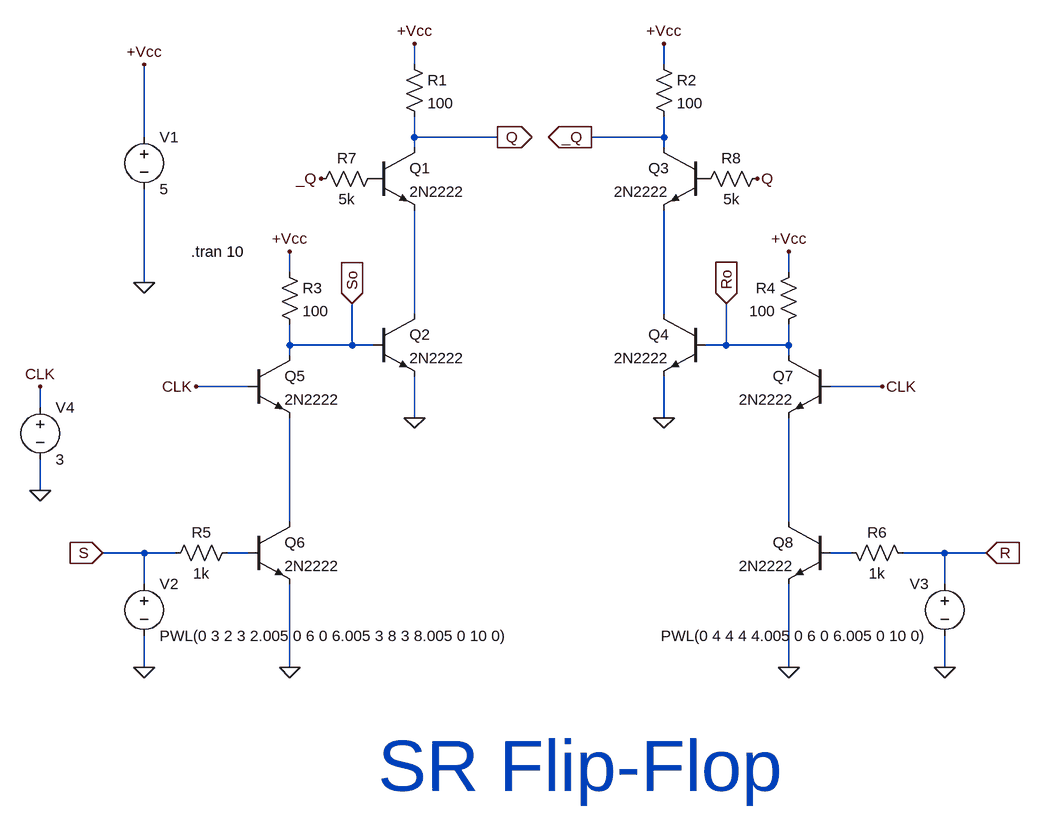
[diagram p0: schematic SR Flip-Flop.asc]
SR Flip-Flop.asc, the LTspice schematic file:
Version 4
SHEET 1 1500 1808
WIRE 80 -112 80 -144
WIRE 464 -112 464 -144
WIRE -336 0 -336 -112
WIRE 80 0 80 -32
WIRE 208 0 80 0
WIRE 464 0 464 -32
WIRE 464 0 352 0
WIRE 80 16 80 0
WIRE 464 16 464 0
WIRE -112 208 -112 176
WIRE 656 208 656 176
WIRE -336 224 -336 80
WIRE 80 272 80 112
WIRE 464 272 464 112
WIRE -112 320 -112 288
WIRE -16 320 -16 256
WIRE -16 320 -112 320
WIRE 16 320 -16 320
WIRE 560 320 560 256
WIRE 560 320 528 320
WIRE 656 320 656 288
WIRE 656 320 560 320
WIRE -112 336 -112 320
WIRE 656 336 656 320
WIRE -176 384 -256 384
WIRE 800 384 720 384
WIRE -496 416 -496 384
WIRE 80 432 80 368
WIRE 464 432 464 368
WIRE -496 544 -496 496
WIRE -112 592 -112 432
WIRE 656 592 656 432
WIRE -336 640 -400 640
WIRE -288 640 -336 640
WIRE -176 640 -208 640
WIRE 752 640 720 640
WIRE 896 640 832 640
WIRE 960 640 896 640
WIRE -336 688 -336 640
WIRE 896 688 896 640
WIRE -336 816 -336 768
WIRE -112 816 -112 688
WIRE 656 816 656 688
WIRE 896 816 896 768
FLAG 80 -144 +Vcc
FLAG 464 -144 +Vcc
FLAG -112 176 +Vcc
FLAG -112 816 0
FLAG 656 176 +Vcc
FLAG 656 816 0
FLAG 208 0 Q
IOPIN 208 0 Out
FLAG 352 0 _Q
IOPIN 352 0 Out
FLAG 464 432 0
FLAG 80 432 0
FLAG 560 256 Ro
IOPIN 560 256 In
FLAG -16 256 So
IOPIN -16 256 In
FLAG -336 -112 +Vcc
FLAG -336 224 0
FLAG -336 816 0
FLAG -400 640 S
IOPIN -400 640 In
FLAG 896 816 0
FLAG 960 640 R
IOPIN 960 640 In
FLAG -256 384 CLK
FLAG 800 384 CLK
FLAG 608 64 Q
FLAG -64 64 _Q
FLAG -496 544 0
FLAG -496 384 CLK
SYMBOL npn 16 16 R0
SYMATTR InstName Q1
SYMATTR Value 2N2222
SYMBOL npn 16 272 R0
SYMATTR InstName Q2
SYMATTR Value 2N2222
SYMBOL npn 528 16 M0
SYMATTR InstName Q3
SYMATTR Value 2N2222
SYMBOL npn 528 272 M0
SYMATTR InstName Q4
SYMATTR Value 2N2222
SYMBOL Res 64 -128 R0
SYMATTR InstName R1
SYMATTR Value 100
SYMBOL Res 448 -128 R0
SYMATTR InstName R2
SYMATTR Value 100
SYMBOL npn -176 336 R0
SYMATTR InstName Q5
SYMATTR Value 2N2222
SYMBOL npn -176 592 R0
SYMATTR InstName Q6
SYMATTR Value 2N2222
SYMBOL Res -128 192 R0
SYMATTR InstName R3
SYMATTR Value 100
SYMBOL npn 720 336 M0
SYMATTR InstName Q7
SYMATTR Value 2N2222
SYMBOL npn 720 592 M0
SYMATTR InstName Q8
SYMATTR Value 2N2222
SYMBOL Res 672 192 M0
SYMATTR InstName R4
SYMATTR Value 100
SYMBOL voltage -336 -16 R0
SYMATTR InstName V1
SYMATTR Value 5
SYMBOL Res -192 624 R90
WINDOW 0 0 56 VBottom 2
WINDOW 3 32 56 VTop 2
SYMATTR InstName R5
SYMATTR Value 1k
SYMBOL voltage -336 672 R0
SYMATTR InstName V2
SYMATTR Value PWL(0 3 2 3 2.005 0 6 0 6.005 3 8 3 8.005 0 10 0)
SYMBOL voltage 896 672 M0
SYMATTR InstName V3
SYMATTR Value PWL(0 4 4 4 4.005 0 6 0 6.005 0 10 0)
SYMBOL Res 848 656 M270
WINDOW 0 32 56 VTop 2
WINDOW 3 0 56 VBottom 2
SYMATTR InstName R6
SYMATTR Value 1k
SYMBOL Res 32 48 R90
WINDOW 0 0 56 VBottom 2
WINDOW 3 32 56 VTop 2
SYMATTR InstName R7
SYMATTR Value 5k
SYMBOL Res 624 48 R90
WINDOW 0 0 56 VBottom 2
WINDOW 3 32 56 VTop 2
SYMATTR InstName R8
SYMATTR Value 5k
SYMBOL voltage -496 400 R0
SYMATTR InstName V4
SYMATTR Value 3
TEXT -264 176 Left 2 !.tran 10
TEXT 24 968 Left 7 ;SR Flip-Flop

The netlist it stands for:
* SR Flip-Flop.asc
Q1 Q P001 N001 0 2N2222
Q2 N001 So 0 0 2N2222
Q3 _Q P002 N002 0 2N2222
Q4 N002 Ro 0 0 2N2222
R1 +Vcc Q 100
R2 +Vcc _Q 100
Q5 So CLK N003 0 2N2222
Q6 N003 N005 0 0 2N2222
R3 +Vcc So 100
Q7 Ro CLK N004 0 2N2222
Q8 N004 N006 0 0 2N2222
R4 +Vcc Ro 100
V1 +Vcc 0 5
R5 N005 S 1k
V2 S 0 PWL(0 3 2 3 2.005 0 6 0 6.005 3 8 3 8.005 0 10 0)
V3 R 0 PWL(0 4 4 4 4.005 0 6 0 6.005 0 10 0)
R6 R N006 1k
R7 P001 _Q 5k
R8 Q P002 5k
V4 CLK 0 3
.model NPN NPN
.model PNP PNP
.lib standard.bjt
.tran 10
* SR Flip-Flop
.backanno
.end